# EAGLE design Crazy Volts (EAGLE 7.1.0)
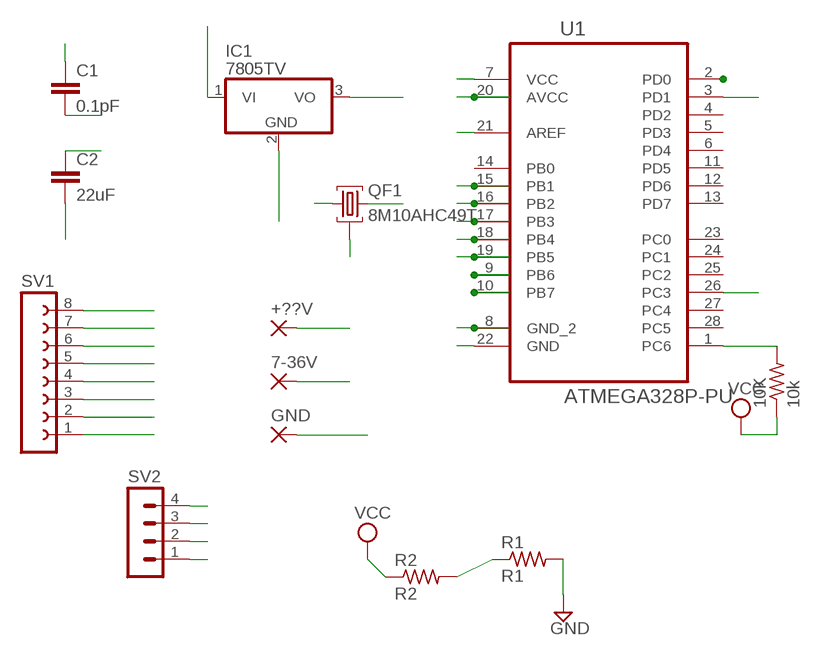
[diagram p0: schematic, sheet 1]

## Parts
7-36V  1,6/0,9  [1,6/0,9]
10K  10k  R-US_0207/7  [0207/7]
+??V  1,6/0,9  [1,6/0,9]
C1  0.1pF  C5/2.5  [C5B2.5]
C2  22uF  C2.5/5  [C2.5-5]
GND  1,6/0,9  [1,6/0,9]
IC1  7805TV  [TO220V]
QF1  8M10AHC49T  [HC49U]
R1  R1  R-US_0207/7  [0207/7]
R2  R2  R-US_0207/7  [0207/7]
SV1  FE08-1  [FE08]
SV2  MA04-1  [MA04-1]
U1  ATMEGA328P-PU  [DIP254P762X457-28]

## Nets
3V3: SV1.6
DISP_CLK: SV1.2 U1.16(PB2)
DISP_CS: SV1.5 U1.18(PB4)
DISP_DATA: SV1.1 U1.15(PB1)
DISP_DC: SV1.3 U1.17(PB3)
DISP_RST: SV1.4 U1.19(PB5)
GND: C1.2 C2.2 GND.1(P) IC1.2(GND) QF1.2 R1.2 SV1.8 SV2.1 U1.8(GND_2) U1.22(GND)
IC9: QF1.3 U1.9(PB6)
IC10: QF1.1 U1.10(PB7)
RST: 10K.2 SV2.4 U1.1(PC6)
RX: SV2.3 U1.2(PD0)
TX: SV2.2 U1.3(PD1)
VBATT: +??V.1(P) R2.1 ; supply symbol labelled VCC
VCC: 10K.1 C1.1 IC1.3(VO) SV1.7 U1.7(VCC) U1.20(AVCC) U1.21(AREF)
VIN: 7-36V.1(P) C2.1 IC1.1(VI)
VSENSE: R1.1 R2.2 U1.26(PC3)
Unconnected: U1.4(PD2) U1.5(PD3) U1.6(PD4) U1.11(PD5) U1.12(PD6) U1.13(PD7) U1.14(PB0) U1.23(PC0) U1.24(PC1) U1.25(PC2) U1.27(PC4) U1.28(PC5)

## Library data of the parts
7-36V +??V GND = wirepad:1,6/0,9: THROUGH-HOLE PAD
10K R1 R2 = rcl:R-US_: RESISTOR, American symbol
C1 C2 = capacitor-wima:C: CAPACITOR naming: grid - package width
IC1 = linear:78*: Positive VOLTAGE REGULATOR Source: http://cache.national.com/ds/LM/LM78L05.pdf http://www.fairchildsemi.com/ds/LM/LM7805.pdf
QF1 = crystal:8M10AHC49T: Monolithic Crystal Filters Source: www.vanlong.com; OC_FARNELL: unknown; OC_NEWARK: unknown
SV1 = con-lsta:FE08-1: FEMALE HEADER; OC_FARNELL: unknown; OC_NEWARK: unknown
SV2 = con-lstb:MA04-1: PIN HEADER; OC_FARNELL: unknown; OC_NEWARK: unknown
U1 = Atmel_By_element14_Batch_1-00:ATMEGA328P-PU: 8-bit Microcontroller with In-System Programmable Flash; MPN: ATMEGA328P-PU; OC_FARNELL: 1715487; OC_NEWARK: 15R0268; PACKAGE: PDIP-28; SUPPLIER: Atmel

## Board
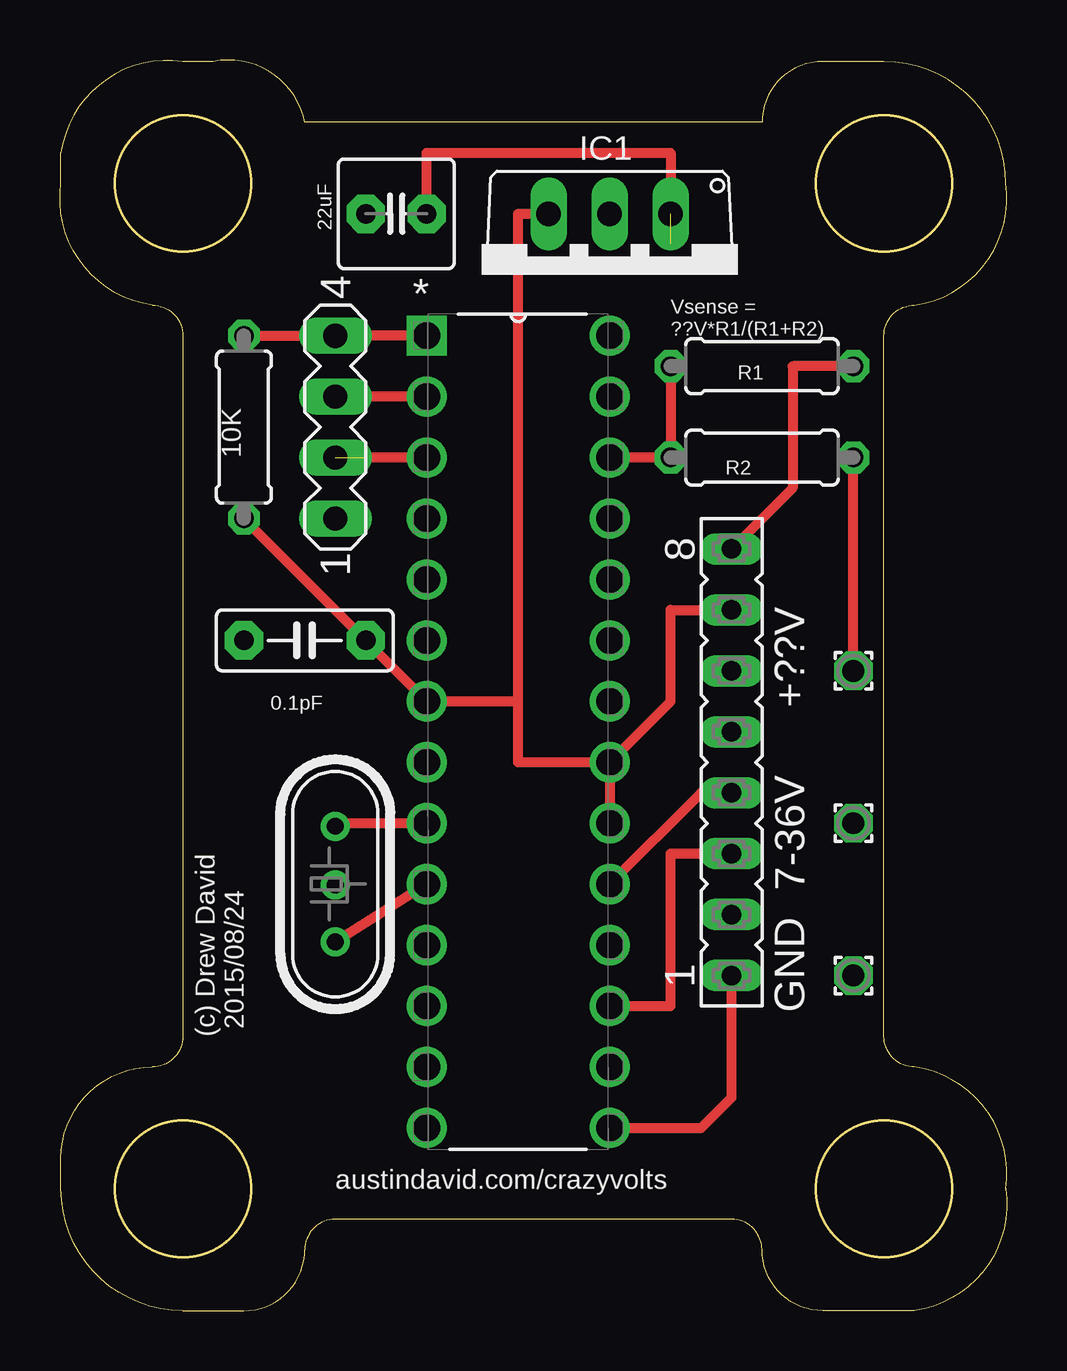
[diagram p1: board, top side]
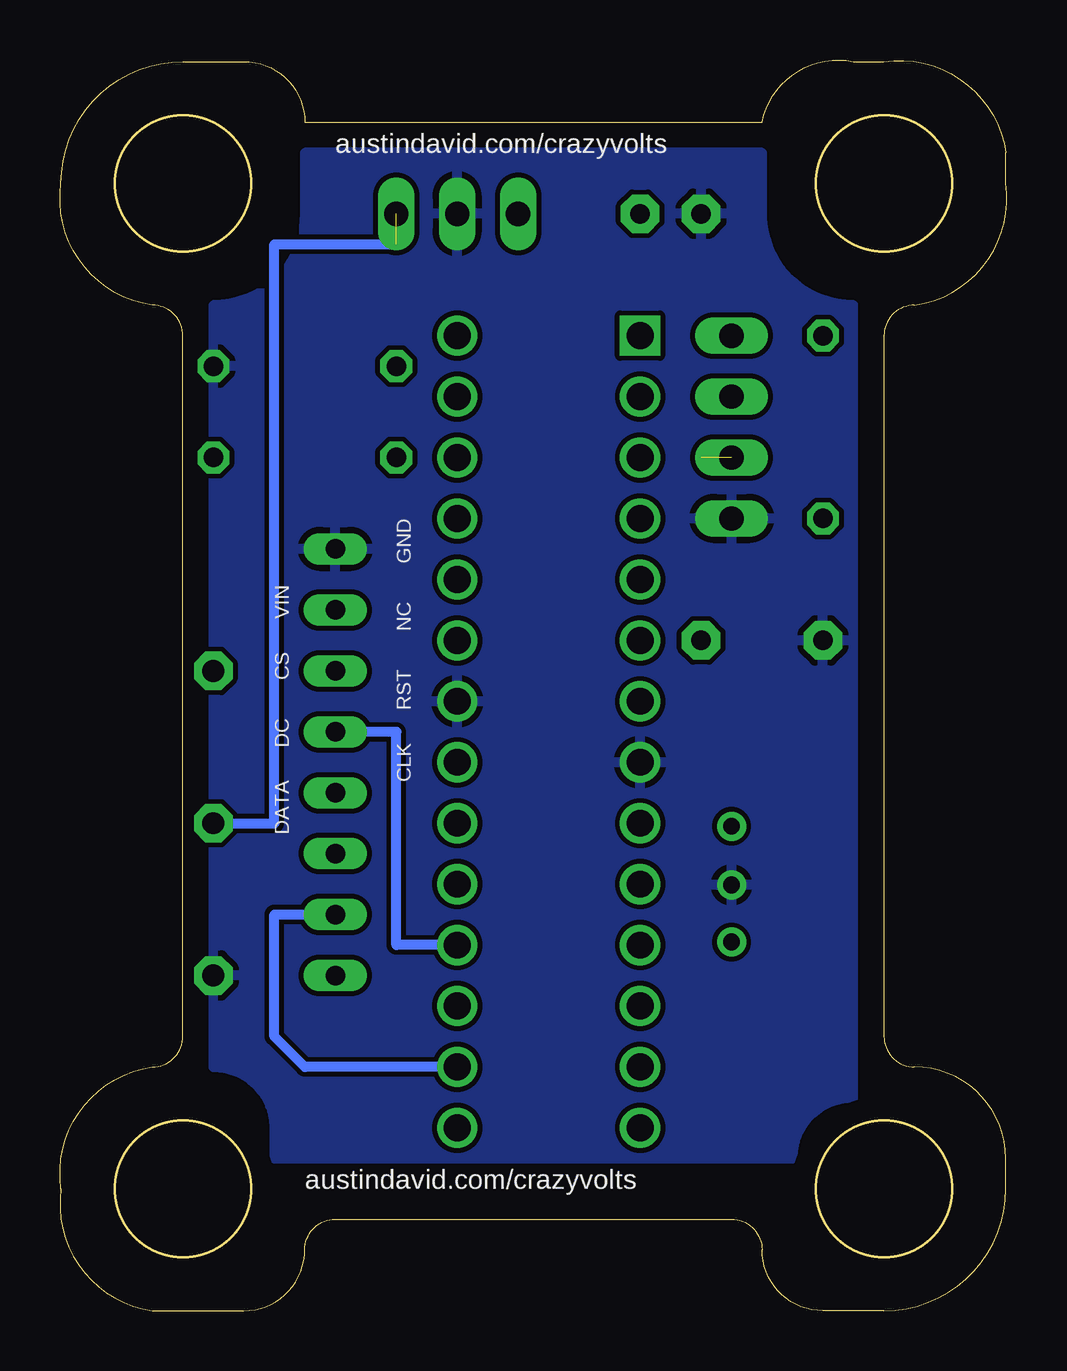
[diagram p2: board, bottom side, seen from below]

Size 39.45 x 52.13 mm. Coordinates in mm from the lower left corner, seen from the top.
Outline: 39.41,5.08 arc-90 35.6,0 31.79,0 arc-90 29.25,2.54 arc90 27.98,3.81 11.47,3.81 arc90 10.2,2.54 arc-90 7.66,0 5.12,0 arc-90 0.04,5.08 0.04,6.35 arc-90 3.85,10.16 arc90 5.12,11.43 5.12,40.64 arc90 3.85,41.91 arc-90 0.04,46.99 0.04,48.26 arc-90 5.12,52.07 6.39,52.07 arc-90 10.2,49.53 29.25,49.53 arc-90 31.79,52.07 34.33,52.07 arc-90 39.41,46.99 arc-90 35.6,41.91 arc90 34.33,40.64 34.33,11.43 arc90 35.6,10.16 arc-90 39.41,5.08
Outline: circle at 5.12,46.99 radius 2.84
Outline: circle at 34.33,46.99 radius 2.84
Outline: circle at 34.33,5.08 radius 2.84
Outline: circle at 5.12,5.08 radius 2.84
Copper layers (1*16): Top 0.035mm / dielectric 1.5mm / Bottom 0.035mm
Design rules "default": minimum track width 10mil, minimum drill 24mil, track to track 8mil, track to pad 8mil, pad to pad 8mil, via to via 8mil, smd to smd 8mil, copper to edge 40mil, drill to drill 8mil, minimum pad ring 10mil, minimum via ring 8mil, stop-mask expansion 4mil, vias tented up to drill 0mil, thermal gap 10mil

### Footprints (pad centres in the part's own frame; a part is rotated, then mirrored left to right if it is on the bottom)
1,6/0,9 = drill 0.914 pad 1.6 octagon: 1 0,0
0207/7 = drill 0.813 octagon: 1 -3.81,0; 2 3.81,0
C5B2.5 = drill 0.813 pad 1.6 octagon: 1 -2.54,0; 2 2.54,0
C2.5-5 = drill 0.813 pad 1.6 octagon: 1 -1.27,0; 2 1.27,0
TO220V = drill 1.016 long: 1 -2.54,-2.54; 2 0,-2.54; 3 2.54,-2.54
HC49U = drill 0.7 pad 1.2: 1 -2.413,0; 2 -0.027,0; 3 2.413,0
FE08 = drill 0.813 long: 1 -8.89,0; 2 -6.35,0; 3 -3.81,0; 4 -1.27,0; 5 1.27,0; 6 3.81,0; 7 6.35,0; 8 8.89,0
MA04-1 = drill 1.016 long: 1 -3.81,0; 2 -1.27,0; 3 1.27,0; 4 3.81,0
DIP254P762X457-28 = drill 1.118 square: 1 -7.62,33.02 | drill 1.118: 2 -7.62,30.48; 3 -7.62,27.94; 4 -7.62,25.4; 5 -7.62,22.86; 6 -7.62,20.32; 7 -7.62,17.78; 8 -7.62,15.24; 9 -7.62,12.7; 10 -7.62,10.16; 11 -7.62,7.62; 12 -7.62,5.08; 13 -7.62,2.54; 14 -7.62,0; 15 0,0; 16 0,2.54; 17 0,5.08; 18 0,7.62; 19 0,10.16; 20 0,12.7; 21 0,15.24; 22 0,17.78; 23 0,20.32; 24 0,22.86; 25 0,25.4; 26 0,27.94; 27 0,30.48; 28 0,33.02

### Placement (x,y rotation side)
7-36V  33.06,20.32 0 top
10K  7.66,36.83 90 top
+??V  33.06,26.67 0 top
C1  10.2,27.94 180 top
C2  14.01,45.72 180 top
GND  33.06,13.97 0 top
IC1  22.9,43.18 180 top
QF1  11.47,17.78 90 top
R1  29.25,39.37 0 top
R2  29.25,35.56 180 top
SV1  27.98,22.86 90 top
SV2  11.47,36.83 90 top
U1  22.9,7.62 0 top

### Tracks (layer width: path | path; a pad name or v marks a point on that pad's centre or on a via)
DISP_CLK
  Bottom 0.406: U1.16 29.25,10.16 30.52,11.43 30.52,16.51 SV1.2
DISP_CS
  Bottom 0.406: SV1.5 25.44,24.13 25.44,15.24 U1.18
DISP_DATA
  Top 0.406: U1.15 26.71,7.62 27.98,8.89 SV1.1
DISP_DC
  Top 0.406: U1.17 25.44,12.7 25.44,19.05 SV1.3
DISP_RST
  Top 0.406: U1.19 26.71,21.59 SV1.4
GND
  Top 0.406: R1.2 30.52,39.37 30.52,34.29 SV1.8
  pour Bottom: 10.2,48.26 29.25,48.26 29.25,45.72 arc90 33.06,41.91 33.06,10.16 arc90 30.52,7.62 30.52,6.35 8.93,6.35 arc90 6.39,8.89 6.39,41.91 arc90 10.2,45.72
IC9
  Top 0.406: U1.9 11.47,20.32 QF1.3
IC10
  Top 0.406: U1.10 QF1.1
RST
  Top 0.406: U1.1 SV2.4 10K.2
RX
  Top 0.406: U1.2 SV2.3
TX  (1 unrouted)
  Top 0.406: U1.3 12.74,35.56
VBATT
  Top 0.406: +??V.1 R2.1
VCC
  Top 0.406: 10K.1 C1.1 U1.7 19.09,25.4 | U1.21 U1.20 | U1.21 19.09,22.86 19.09,25.4 | 19.09,25.4 19.09,45.72 IC1.3 | U1.21 25.44,25.4 25.44,29.21 SV1.7
VIN  (1 unrouted)
  Top 0.406: C2.1 15.28,48.26 25.44,48.26 IC1.1
  Bottom 0.406: 7-36V.1 30.52,20.32 30.52,44.45 25.44,44.45
VSENSE
  Top 0.406: R1.1 R2.2 U1.26

### Text on the board
tNames: Vsense = / ??V*R1/(R1+R2) | (c) Drew David / 2015/08/24 | austindavid.com/crazyvolts
bNames: austindavid.com/crazyvolts | CLK RST NC GND | DATA DC CS VIN | austindavid.com/crazyvolts